# EAGLE design piprog_v1 (EAGLE 7.5.0)
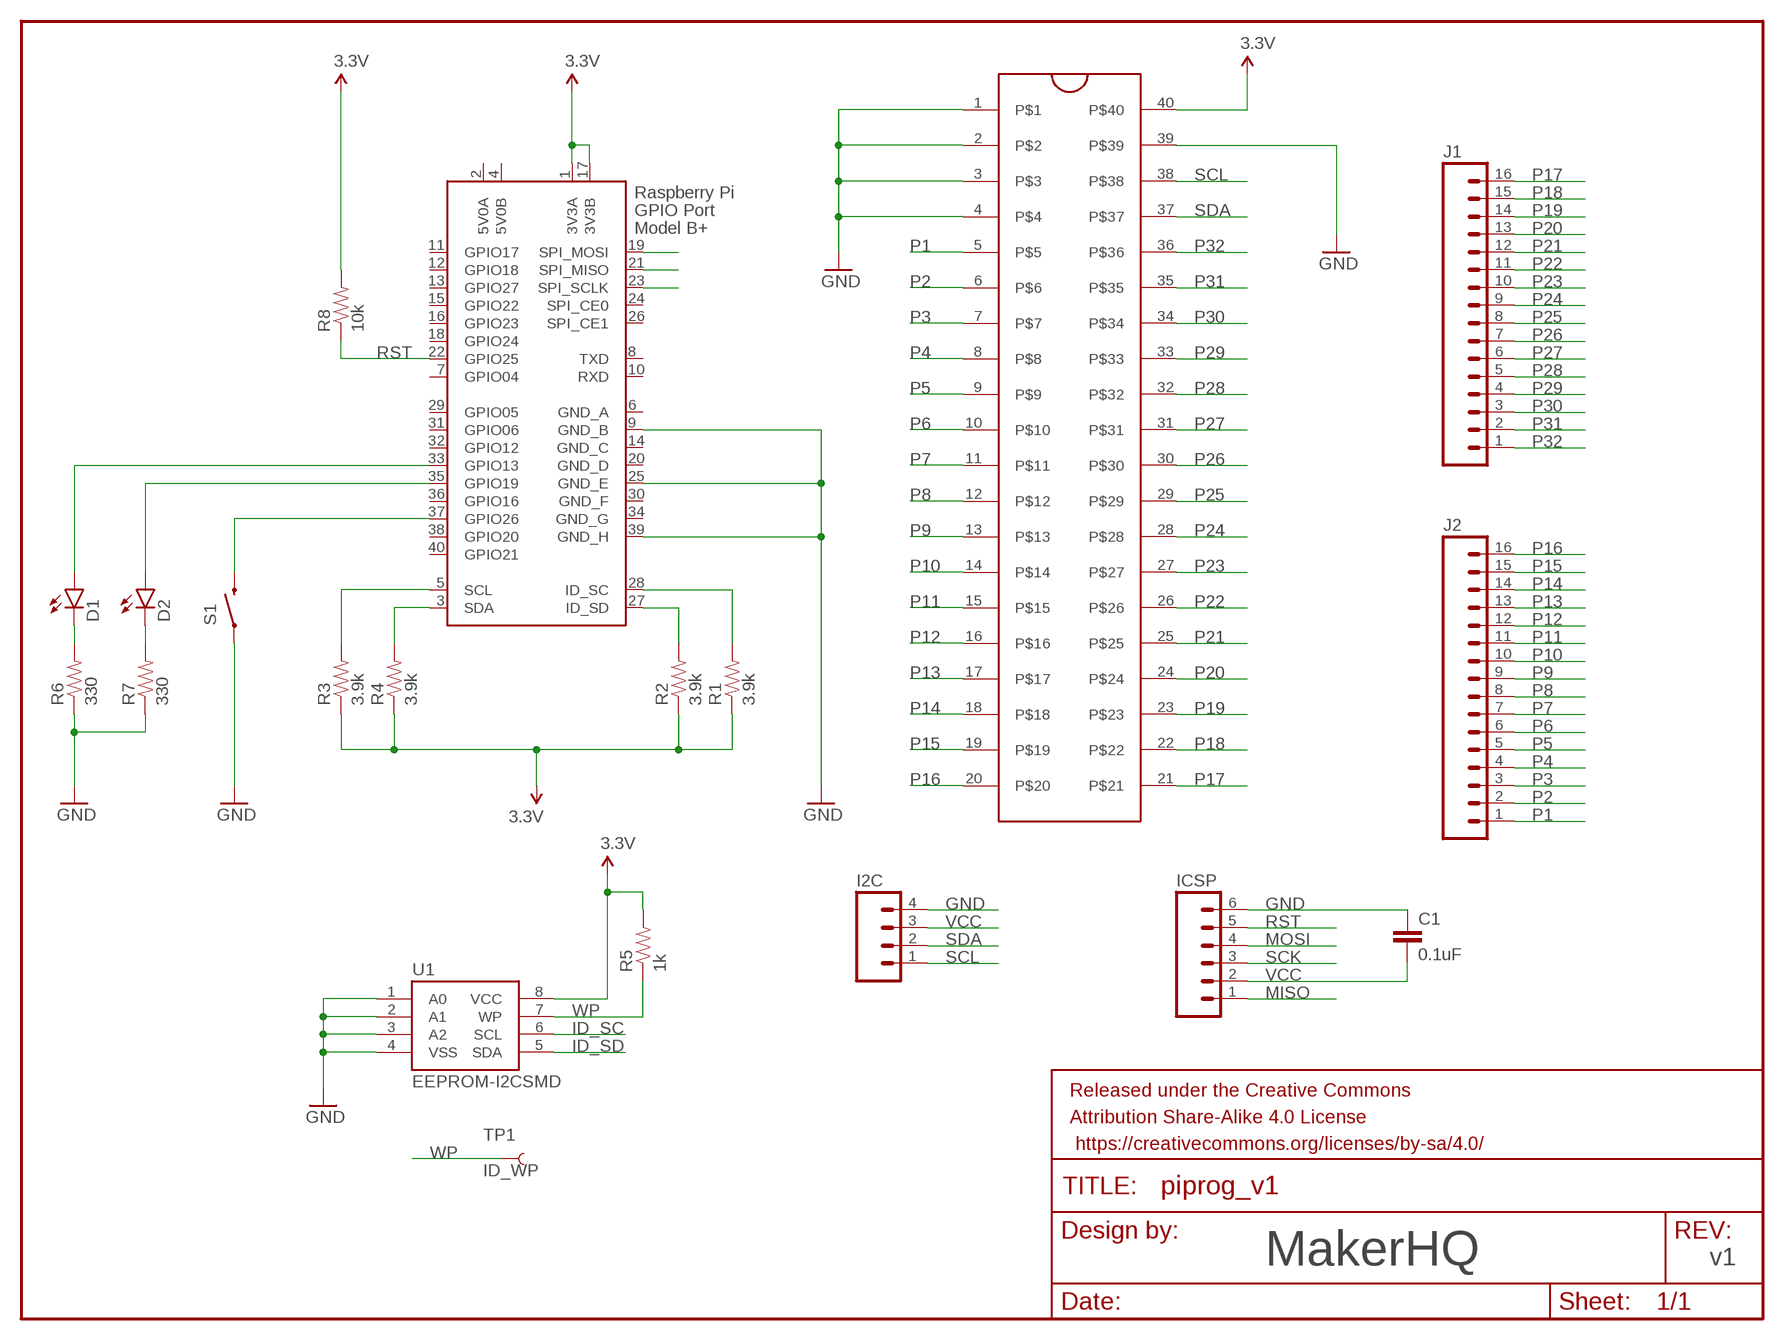
[diagram p0: schematic, sheet 1]

## Parts
C1  0.1uF  CAPPTH  [CAP-PTH-SMALL]
D1  LED3MM  [LED3MM]
D2  LED3MM  [LED3MM]
FRAME1  FRAME-LETTERNO_PACKAGE  [DUMMY]
I2C  M04PTH  [1X04]
ICSP  M06SILK_FEMALE_PTH  [1X06]
J1  M16PTH  [1X16]
J2  M16PTH  [1X16]
R1  3.9k  RESISTORPTH-1/4W  [AXIAL-0.4]
R2  3.9k  RESISTORPTH-1/4W  [AXIAL-0.4]
R3  3.9k  RESISTORPTH-1/4W  [AXIAL-0.4]
R4  3.9k  RESISTORPTH-1/4W  [AXIAL-0.4]
R5  1k  RESISTORPTH-1/4W  [AXIAL-0.4]
R6  330  RESISTORPTH-1/4W  [AXIAL-0.4]
R7  330  RESISTORPTH-1/4W  [AXIAL-0.4]
R8  10k  RESISTORPTH-1/4W  [AXIAL-0.4]
S1  SWITCH-MOMENTARY-2PTH  [TACTILE-PTH]
TP1  ID_WP  TEST-POINT3X4  [PAD.03X.04]
U1  EEPROM-I2CSMD  [SO08]
U$2  ZIFSOCKET-40-6DIL40-6-ZIF_SOCKET  [DIL40-6-ZIF_SOCKET]
X1  RASPI_BOARD_B+#_HD  [RASPI_BOARD_B+HAT_DF]

## Nets
GND: C1.1 I2C.4 ICSP.6 R6.P$1 R7.P$1 S1.1 U1.1(A0) U1.2(A1) U1.3(A2) U1.4(VSS) U$2.1 U$2.2 U$2.3 U$2.4 U$2.39 X1.9(GND_B) X1.25(GND_E) X1.39(GND_H)
ID_SC: R1.P$2 U1.6(SCL) X1.28(ID_SC)
ID_SD: R2.P$2 U1.5(SDA) X1.27(ID_SD)
MISO: ICSP.1 X1.21(SPI_MISO)
MOSI: ICSP.4 X1.19(SPI_MOSI)
N$1: D2.K(C) R7.P$2
N$2: D1.K(C) R6.P$2
N$3: D1.A X1.33(GPIO13)
N$4: D2.A X1.35(GPIO19)
N$5: S1.3 X1.37(GPIO26)
P1: J2.1 U$2.5
P2: J2.2 U$2.6
P3: J2.3 U$2.7
P4: J2.4 U$2.8
P5: J2.5 U$2.9
P6: J2.6 U$2.10
P7: J2.7 U$2.11
P8: J2.8 U$2.12
P9: J2.9 U$2.13
P10: J2.10 U$2.14
P11: J2.11 U$2.15
P12: J2.12 U$2.16
P13: J2.13 U$2.17
P14: J2.14 U$2.18
P15: J2.15 U$2.19
P16: J2.16 U$2.20
P17: J1.16 U$2.21
P18: J1.15 U$2.22
P19: J1.14 U$2.23
P20: J1.13 U$2.24
P21: J1.12 U$2.25
P22: J1.11 U$2.26
P23: J1.10 U$2.27
P24: J1.9 U$2.28
P25: J1.8 U$2.29
P26: J1.7 U$2.30
P27: J1.6 U$2.31
P28: J1.5 U$2.32
P29: J1.4 U$2.33
P30: J1.3 U$2.34
P31: J1.2 U$2.35
P32: J1.1 U$2.36
RST: ICSP.5 R8.P$1 X1.22(GPIO25)
SCK: ICSP.3 X1.23(SPI_SCLK)
SCL: I2C.1 R3.P$2 U$2.38 X1.5(SCL)
SDA: I2C.2 R4.P$2 U$2.37 X1.3(SDA)
VCC: C1.2 I2C.3 ICSP.2 R1.P$1 R2.P$1 R3.P$1 R4.P$1 R5.P$2 R8.P$2 U1.8(VCC) U$2.40 X1.1(3V3A) X1.17(3V3B) ; supply symbol labelled 3.3V
WP: R5.P$1 TP1.P$1 U1.7(WP)
Unconnected: X1.7(GPIO04) X1.8(TXD) X1.10(RXD) X1.11(GPIO17) X1.12(GPIO18) X1.13(GPIO27) X1.15(GPIO22) X1.16(GPIO23) X1.18(GPIO24) X1.24(SPI_CE0) X1.26(SPI_CE1) X1.29(GPIO05) X1.31(GPIO06) X1.32(GPIO12) X1.36(GPIO16) X1.38(GPIO20) X1.40(GPIO21)

## Notes on the sheet
- MakerHQ | v1

## Power pins joined to a net without a drawn wire
5V0A: X1.2(5V0A)
5V0B: X1.4(5V0B)
GND_A: X1.6(GND_A)
GND_C: X1.14(GND_C)
GND_D: X1.20(GND_D)
GND_F: X1.30(GND_F)
GND_G: X1.34(GND_G)

## Library data of the parts
C1 = SparkFun-Passives:CAP: Capacitor Standard 0603 ceramic capacitor, and 0.1" leaded capacitor.
D1 D2 = SparkFun-LED:LED: LEDs Standard schematic elements and footprints for 5mm, 3mm, 1206, and 0603 sized LEDs. 5mm - Spark Fun Electronics SKU : COM-00529 (and others); PROD_ID: DIO-08794
FRAME1 = SparkFun-Aesthetics:FRAME-LETTER: Schematic Frame Standard 8.5x11 US Letter frame; DESIGNER: Nobody; VERSION: v01
I2C = SparkFun-Connectors:M04: Header 4 Standard 4-pin 0.1" header. Use with straight break away headers (SKU : PRT-00116), right angle break away headers (PRT-00553), swiss pins (PRT-00743), machine pins (PRT-00117), and female headers (PRT-00115). Molex polarized connector foot print use with SKU : PRT-08231 with associated crimp pins and housings. 1MM SMD Version SKU: PRT-10208; PROD_ID: CONN-09696
ICSP = SparkFun-Connectors:M06: Header 6 Standard 6-pin 0.1" header. Use with straight break away headers (SKU : PRT-00116), right angle break away headers (PRT-00553), swiss pins (PRT-00743), machine pins (PRT-00117), and female headers (PRT-00115). Molex polarized connector foot print use with SKU : PRT-08094 with associated crimp pins and housings. NOTES ON THE VARIANTS LOCK and LOCK_LONGPADS... This footprint was designed to help hold the alignment of a through-hole component (i.e. 6-pin header) while soldering it into place. You may notice that each hole has been shifted either up or down by 0.005 of an inch from it's more standard position (which is a perfectly straight line). This slight alteration caused the pins (the squares in the middle) to touch the edges of the holes. Because they are alternating, it causes a "brace" to hold the component in place. 0.005 has proven to be the perfect amount of "off-center" position when using our standard breakaway headers. Although looks a little odd when you look at the bare footprint, once you have a header in there, the alteration is very hard to notice. Also,if you push a header all the way into place, it is covered up entirely on the bottom side. This idea of altering the position of holes to aid alignment will be further integrated into the Sparkfun Library for other footprints. It can help hold any component with 3 or more connection pins.; PROD_ID: CONN-08437
J1 J2 = SparkFun-Connectors:M16: 1x16 .1" header
R1-R8 = SparkFun-Passives:RESISTOR: Resistor Basic schematic elements and footprints for 0603, 1206, and PTH resistors.
S1 = SparkFun-Electromechanical:SWITCH-MOMENTARY-2: Various NO switches- pushbuttons, reed, etc; PROD_ID: SWCH-08441
TP1 = SparkFun-Passives:TEST-POINT: Bare copper test points for troubleshooting or ICT
U1 = SparkFun-DigitalIC:EEPROM-I2C: I2C EEPROM chips, 24LC256 (and others)
U$2 = SparkFun-Connectors:ZIFSOCKET-40-6: Lever-action ZIF socket for 40-pin ICs
X1 = raspberrypi_bastelstube_v13:RASPI_BOARD_B+#: Raspberry Pi GPIO connector with markings for the outer dimensions of the Raspberry Pi board model B+ with different sets of drill holes or mounting pads All pins connected

## Board
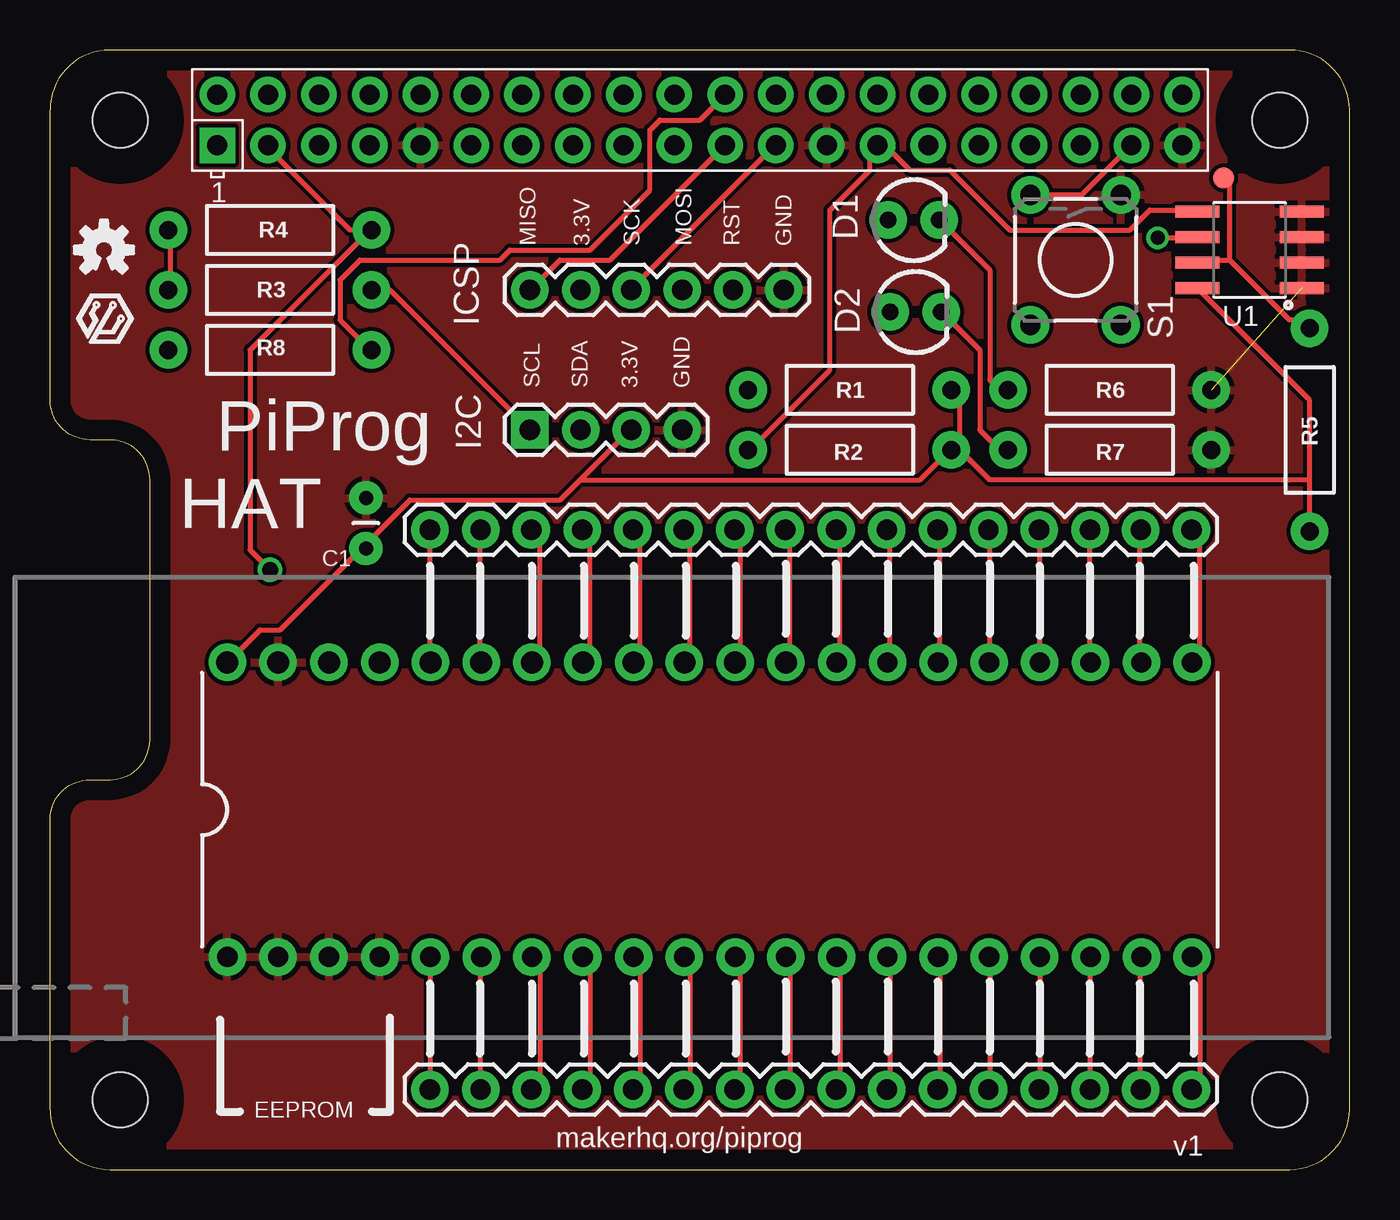
[diagram p1: board, top side]
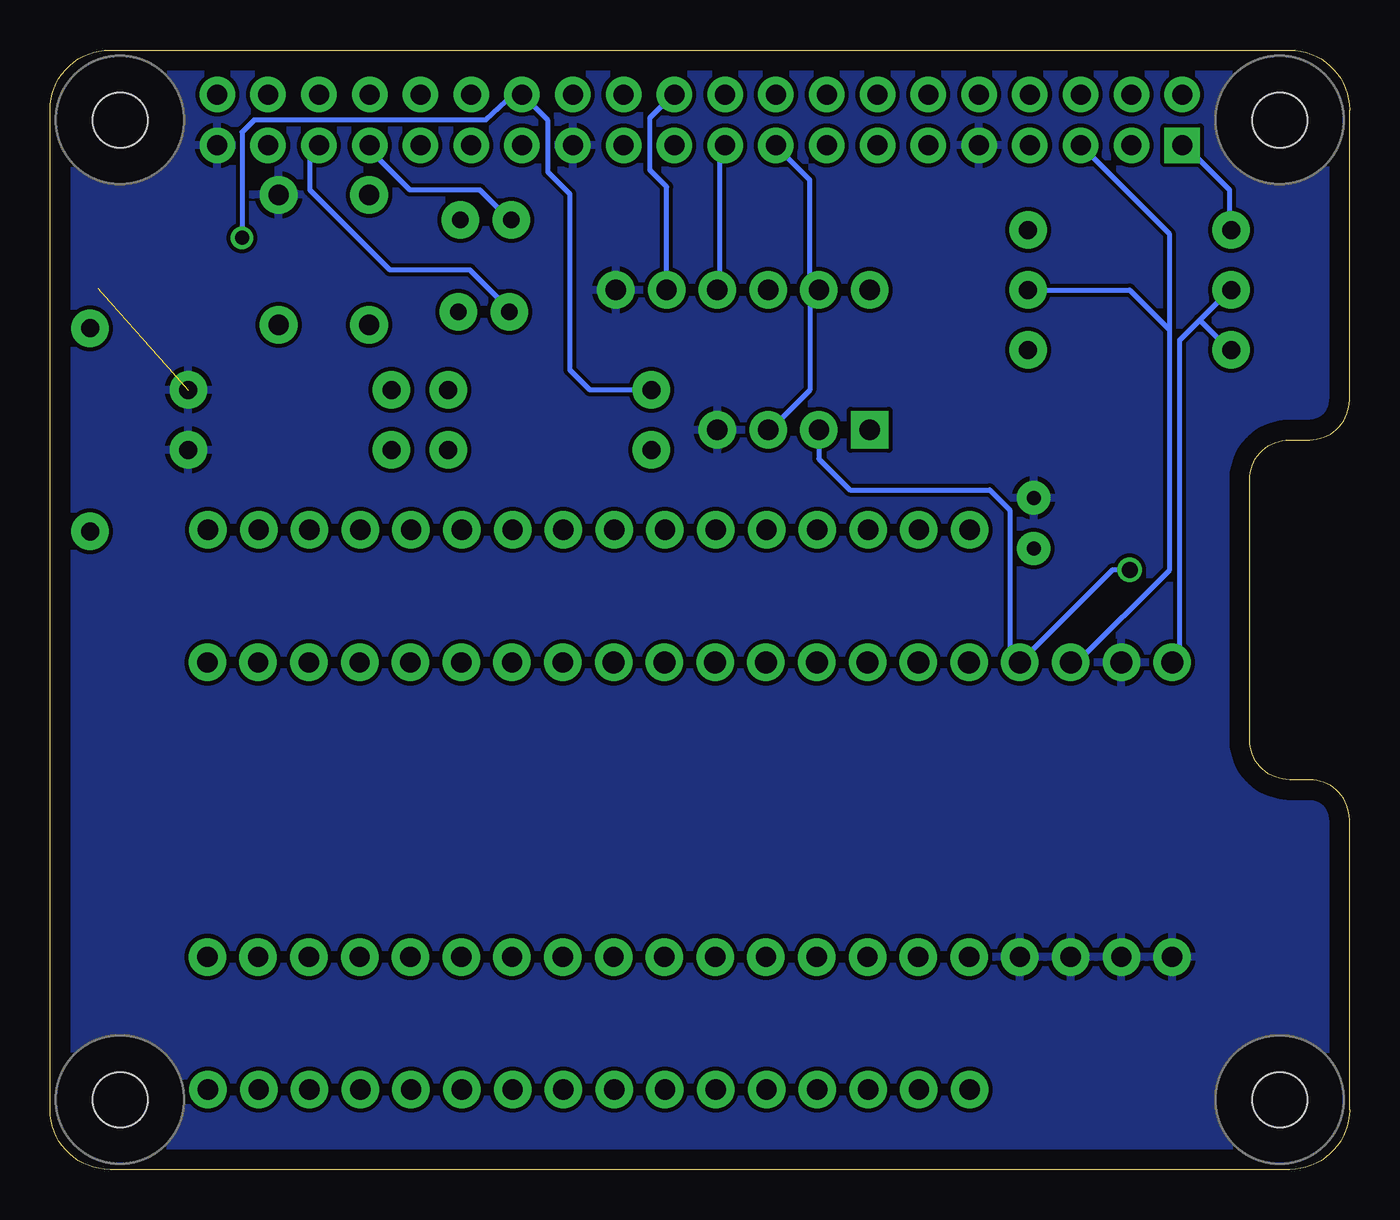
[diagram p2: board, bottom side, seen from below]

Size 65 x 56 mm. Coordinates in mm from the lower left corner, seen from the top.
Copper layers (1*16): Top 0.035mm / dielectric 1.5mm / Bottom 0.035mm
Design rules "default": minimum track width 10mil, minimum drill 24mil, track to track 8mil, track to pad 8mil, pad to pad 8mil, via to via 8mil, smd to smd 8mil, copper to edge 40mil, drill to drill 8mil, minimum pad ring 10mil, minimum via ring 8mil, stop-mask expansion 4mil, vias tented up to drill 0mil, thermal gap 10mil
tRestrict: area 1.2,50.2 to 5.8,54.8; area 59.2,50.2 to 63.8,54.8; area 59.2,1.2 to 63.8,5.8; area 1.2,1.2 to 5.8,5.8
bRestrict: area 59.2,50.2 to 63.8,54.8; area 1.2,50.2 to 5.8,54.8; area 1.2,1.2 to 5.8,5.8; area 59.2,1.2 to 63.8,5.8

### Footprints (pad centres in the part's own frame; a part is rotated, then mirrored left to right if it is on the bottom)
CAP-PTH-SMALL = drill 0.7 pad 1.651: 1 0,0; 2 2.54,0
LED3MM = drill 0.813 pad 1.88: A -1.27,0; K 1.27,0
1X04 = drill 1.016 pad 1.88 square: 1 0,0 | drill 1.016 pad 1.88: 2 2.54,0; 3 5.08,0; 4 7.62,0
1X06 = drill 1.016 pad 1.88: 1 0,0; 2 2.54,0; 3 5.08,0; 4 7.62,0; 5 10.16,0; 6 12.7,0
1X16 = drill 1.016 pad 1.88: 1 0,0; 2 2.54,0; 3 5.08,0; 4 7.62,0; 5 10.16,0; 6 12.7,0; 7 15.24,0; 8 17.78,0; 9 20.32,0; 10 22.86,0; 11 25.4,0; 12 27.94,0; 13 30.48,0; 14 33.02,0; 15 35.56,0; 16 38.1,0
AXIAL-0.4 = drill 0.9 pad 1.88: P$1 -5.08,0; P$2 5.08,0
TACTILE-PTH = drill 1.016 pad 1.88: 1 -3.251,2.261; 2 3.251,2.261; 3 -3.251,-2.261; 4 3.251,-2.261
PAD.03X.04 = smd 1.016 x 1.016: P$1 0,0
SO08 = smd 0.61 x 2.21: 1 -1.905,-2.616; 2 -0.635,-2.616; 3 0.635,-2.616; 4 1.905,-2.616; 5 1.905,2.616; 6 0.635,2.616; 7 -0.635,2.616; 8 -1.905,2.616
DIL40-6-ZIF_SOCKET = drill 1.016 pad 1.88: 1 -24.13,-7.366; 2 -21.59,-7.366; 3 -19.05,-7.366; 4 -16.51,-7.366; 5 -13.97,-7.366; 6 -11.43,-7.366; 7 -8.89,-7.366; 8 -6.35,-7.366; 9 -3.81,-7.366; 10 -1.27,-7.366; 11 1.27,-7.366; 12 3.81,-7.366; 13 6.35,-7.366; 14 8.89,-7.366; 15 11.43,-7.366; 16 13.97,-7.366; 17 16.51,-7.366; 18 19.05,-7.366; 19 21.59,-7.366; 20 24.13,-7.366; 21 24.13,7.366; 22 21.59,7.366; 23 19.05,7.366; 24 16.51,7.366; 25 13.97,7.366; 26 11.43,7.366; 27 8.89,7.366; 28 6.35,7.366 | drill 1.1 pad 1.88: 29 3.81,7.366; 30 1.27,7.366; 31 -1.27,7.366; 32 -3.81,7.366; 33 -6.35,7.366; 34 -8.89,7.366; 35 -11.43,7.366; 36 -13.97,7.366; 37 -16.51,7.366; 38 -19.05,7.366; 39 -21.59,7.366; 40 -24.13,7.366
RASPI_BOARD_B+HAT_DF = drill 1 pad 1.778 square: 1 8.37,51.23 | drill 1 pad 1.778: 2 8.37,53.77; 3 10.91,51.23; 4 10.91,53.77; 5 13.45,51.23; 6 13.45,53.77; 7 15.99,51.23; 8 15.99,53.77; 9 18.53,51.23; 10 18.53,53.77; 11 21.07,51.23; 12 21.07,53.77; 13 23.61,51.23; 14 23.61,53.77; 15 26.15,51.23; 16 26.15,53.77; 17 28.69,51.23; 18 28.69,53.77; 19 31.23,51.23; 20 31.23,53.77; 21 33.77,51.23; 22 33.77,53.77; 23 36.31,51.23; 24 36.31,53.77; 25 38.85,51.23; 26 38.85,53.77; 27 41.39,51.23; 28 41.39,53.77; 29 43.93,51.23; 30 43.93,53.77; 31 46.47,51.23; 32 46.47,53.77; 33 49.01,51.23; 34 49.01,53.77; 35 51.55,51.23; 36 51.55,53.77; 37 54.09,51.23; 38 54.09,53.77; 39 56.63,51.23; 40 56.63,53.77 | hole 2.75: 3.5,3.5; 3.5,52.5; 61.5,3.5; 61.5,52.5

### Placement (x,y rotation side)
C1  15.8,33.6 270 top
D1  43.2,47.5 0 top
D2  43.3,42.9 0 top
FRAME1  -1,-2 0 top
I2C  24,37 0 top
ICSP  24,44 0 top
J1  19,32 0 top
J2  19,4 0 top
R1  40,39 180 top
R2  40,36 180 top
R3  11,44 0 top
R4  11,47 0 top
R5  63,37 270 top
R6  53,39 180 top
R7  53,36 180 top
R8  11,41 180 top
S1  51.3,45.5 270 top
TP1  58.7,49.6 0 top
U1  60,46 90 top
U$1  [OSHW-LOGO-S]  2.7,46 0 top
U$2  33,18 0 top
U$3  [MAKERHQ_LOGO_S]  1.3,41.3 0 top
X1  0,0 0 top

### Tracks (layer width: path | path; a pad name or v marks a point on that pad's centre or on a via)
GND  (1 unrouted)
  pour Bottom: 0,0 0,19 5,19 5,37 0,37 0,56 65,56 65,0
  pour Top: 0,0 0,19 5,19 5,37 0,37 0,56 65,56 65,0
ID_SC  (via drill 0.7)
  Top 0.254: v55.4,46.6 57.35,46.6 U1.6
  Bottom 0.254: R1.P$2 38,39 39,40 39,48.8 40.1,49.9 40.1,52.48 X1.28 41.83,53.77 43.2,52.5 54.8,52.5 55.4,51.9 v55.4,46.6
ID_SD
  Top 0.254: R2.P$2 35,36 39,40 39,48 41,50 41,50.84 X1.27 41.77,51.23 43,50 45,50 48,47 54,47 55,48 57.29,48 U1.5
MISO
  Top 0.254: ICSP.1 25.5,45.5 28,45.5 33.5,51 X1.21
MOSI
  Bottom 0.254: X1.19 31.5,51 31.5,44 ICSP.4
N$1
  Top 0.254: R7.P$2 47.5,36 46.5,37 46.5,41 45,42.5 D2.K
N$2
  Top 0.254: R6.P$2 47.5,39 47,39.5 47,45 44.5,47.5 D1.K
N$3
  Bottom 0.254: X1.33 49,51 47,49 43.5,49 42,47.5 D1.A
N$4
  Bottom 0.254: D2.A 42.03,43.03 44,45 48,45 52,49 52,50.78 X1.35
N$5
  Top 0.254: S1.3 51.61,48.75 X1.37
P1
  Top 0.254: J2.1 19,10.5 U$2.5
P2
  Top 0.254: J2.2 21.5,4 21.5,10.5 U$2.6
P3
  Top 0.254: J2.3 24.5,4 24.5,10.5 U$2.7
P4
  Top 0.254: J2.4 27,4 27,10.5 U$2.8
P5
  Top 0.254: J2.5 29.5,4 29.5,10.5 U$2.9
P6
  Top 0.254: J2.6 32,4 32,10.5 U$2.10
P7
  Top 0.254: J2.7 34.5,4 34.5,10.5 U$2.11
P8
  Top 0.254: J2.8 37,4 37,10.5 U$2.12
P9
  Top 0.254: J2.9 39.5,4 39.5,10.5 U$2.13
P10
  Top 0.254: J2.10 42,4 42,10.5 U$2.14
P11
  Top 0.254: J2.11 44.5,4 44.5,10.5 U$2.15
P12
  Top 0.254: J2.12 47,4 47,10.5 U$2.16
P13
  Top 0.254: J2.13 49.5,4 49.5,10.5 U$2.17
P14
  Top 0.254: J2.14 52,4 52,10.5 U$2.18
P15
  Top 0.254: J2.15 54.5,4 54.5,10.5 U$2.19
P16
  Top 0.254: J2.16 57.5,4 57.5,10.5 U$2.20
P17
  Top 0.254: J1.16 57.5,32 57.5,25.5 U$2.21
P18
  Top 0.254: J1.15 54.5,32 54.5,25.5 U$2.22
P19
  Top 0.254: J1.14 52,32 52,25.5 U$2.23
P20
  Top 0.254: J1.13 49.5,32 49.5,25.5 U$2.24
P21
  Top 0.254: J1.12 47,32 47,25.5 U$2.25
P22
  Top 0.254: J1.11 44.5,32 44.5,25.5 U$2.26
P23
  Top 0.254: J1.10 42,32 42,25.5 U$2.27
P24
  Top 0.254: J1.9 39.5,32 39.5,25.5 U$2.28
P25
  Top 0.254: J1.8 37,32 37,25.5 U$2.29
P26
  Top 0.254: U$2.30 34.5,25.5 34.5,32 J1.7
P27
  Top 0.254: J1.6 32,32 32,25.5 U$2.31
P28
  Top 0.254: J1.5 29.5,32 29.5,25.5 U$2.32
P29
  Top 0.254: J1.4 27,32 27,25.5 U$2.33
P30
  Top 0.254: J1.3 24.5,32 24.5,25.5 U$2.34
P31
  Top 0.254: J1.2 21.5,32 21.5,25.5 U$2.35
P32
  Top 0.254: J1.1 19,25.5 U$2.36
RST
  Top 0.254: R8.P$1 16,41 14.5,42.5 14.5,44.5 15.5,45.5 22.5,45.5 23,46 27,46 30,49 30,52 30.5,52.5 32.5,52.5 X1.22 | 34,44 ICSP.5
  Bottom 0.254: ICSP.5 34.16,49.16 35,50 35,52.6 34,53.6 X1.22
SCK
  Top 0.254: X1.23 36,51 29,44 ICSP.3
SCL
  Top 0.254: I2C.1 17,44 R3.P$2
  Bottom 0.254: U$2.38 13.63,25.37 9,30 9,42 | 9,42 9,46.78 X1.5 | R3.P$2 11,44 9,42
SDA  (via drill 0.8)
  Top 0.254: X1.3 11,51 15,47 R4.P$2 16,47 10,41 10,31 v11,30
  Bottom 0.254: v11,30 11.86,30 U$2.37 17,25.88 17,33 18,34 25,34 26.54,35.54 I2C.2
VCC
  Top 0.254: R3.P$1 6,44 6,47 R4.P$1 | U$2.40 9,25.5 10.5,27 11.5,27 15.5,31 C1.2 16,31.5 18,33.5 25.5,33.5 26.5,34.5 | 26.5,34.5 29,37 I2C.3 | 26.5,34.5 43.5,34.5 45,36 R2.P$1 45.5,36 | R5.P$2 63,34.5 | 63,34.5 63,38.48 U1.8 | 45.5,36 45.5,39 R1.P$1 | 45.5,36 47,34.5 63,34.5
  Bottom 0.254: 27,44 27,49.5 28.5,51 X1.17 | 27,44 27,39 29,37 I2C.3 | 27,44 ICSP.2 | X1.1 8,51 6,49 6,47 R4.P$1 | 7.5,42.5 8.5,41.5 8.5,25.5 U$2.40 | 7.5,42.5 6,44 R3.P$1 | 7.5,42.5 6,41 R8.P$2
WP
  Top 0.254: 59,45.5 59,49.5 TP1.P$1 | 59,45.5 57.5,45.5 U1.7 | 59,45.5 62,42.5 63,42.5 R5.P$1

### Text on the board
tPlace: ICSP | MISO | 3.3V | SCK | MOSI | RST | GND | I2C | SCL | SDA | 3.3V | GND | PiProg | HAT | EEPROM | v1 | makerhq.org/piprog